# EAGLE schematic just_numitron (EAGLE 9.3.2)
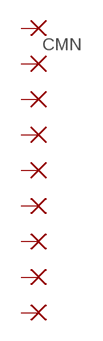
[diagram p0: schematic, sheet 1]

## Parts
CMN  1,6/0,8  [1,6/0,8]
DEC  1,6/0,8  [1,6/0,8]
SEGA  1,6/0,8  [1,6/0,8]
SEGB  1,6/0,8  [1,6/0,8]
SEGC  1,6/0,8  [1,6/0,8]
SEGD  1,6/0,8  [1,6/0,8]
SEGE  1,6/0,8  [1,6/0,8]
SEGF  1,6/0,8  [1,6/0,8]
SEGG  1,6/0,8  [1,6/0,8]
Unconnected: CMN.1(P) DEC.1(P) SEGA.1(P) SEGB.1(P) SEGC.1(P) SEGD.1(P) SEGE.1(P) SEGF.1(P) SEGG.1(P)

## Library data of the parts
CMN DEC SEGA SEGB SEGC SEGD SEGE SEGF SEGG = wirepad:1,6/0,8: THROUGH-HOLE PAD

## Net classes
0 default: width 0.635 mm
1 ground: width 1.27 mm
2 vcc: width 1.27 mm
3 audio: width 1.27 mm